# EAGLE design BPv4LCDadapter.v4b (EAGLE 5.07)
LEFT: FIXED ON; OFF: OFF; ON: ON; RIGHT: AUX CTRL
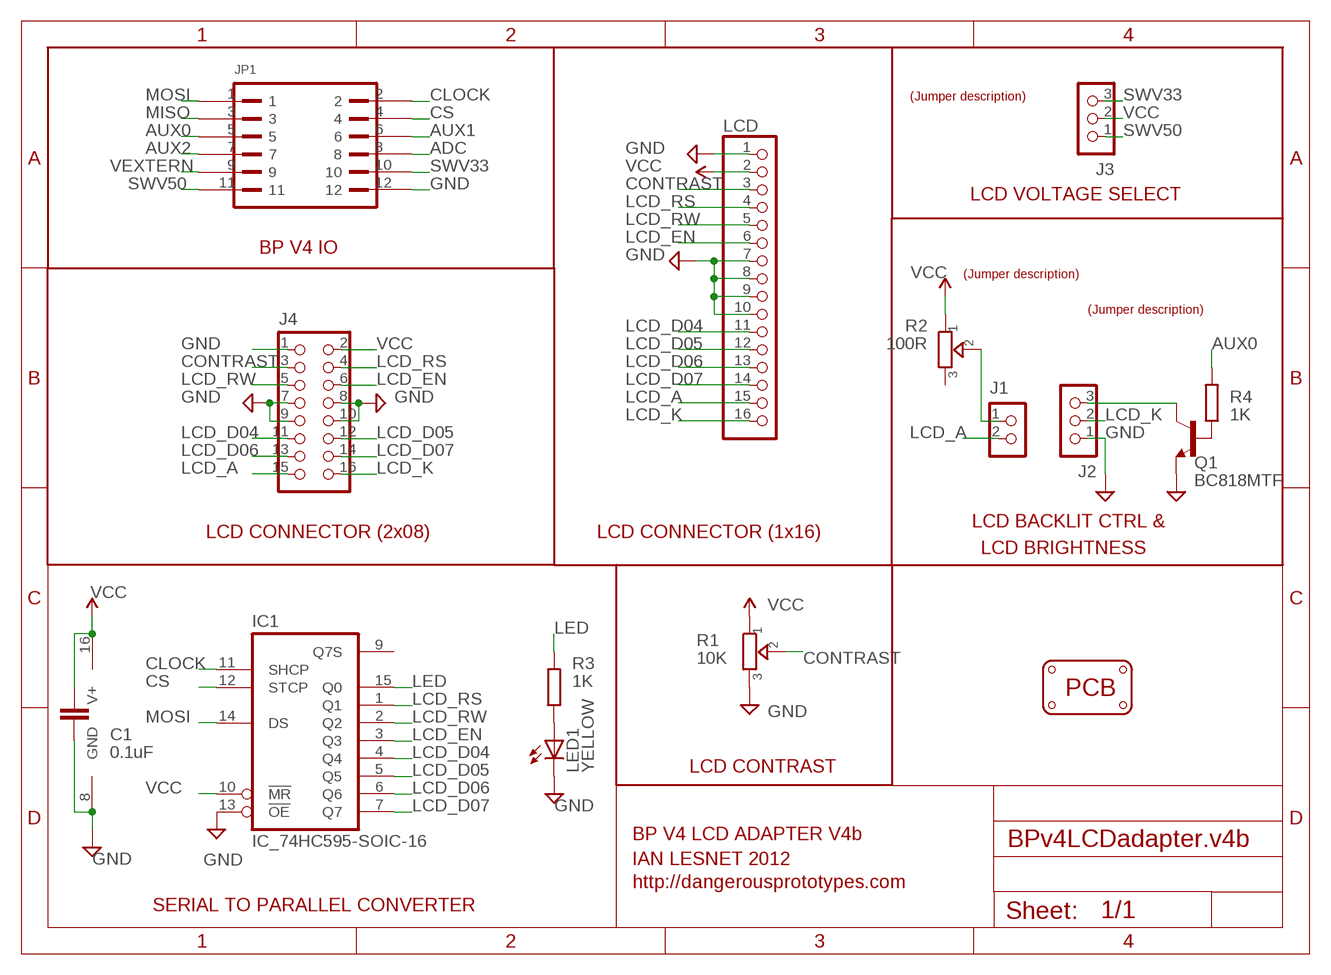
[diagram p0: schematic, sheet 1]

## Parts
C1  0.1uF  CAPACITOR_NPOL-0603  [C603]
IC1  IC_74HC595-SOIC-16  [SOIC-16]
J1  CON_HEADER_1X02-PTH  [M1X2]
J2  CON_HEADER_1X03-PTH  [M1X3]
J3  CON_HEADER_1X03-PTH  [M1X3]
J4  CON_HEADER_2X8  [M2X8]
JP1  PINSHRD-PTH-2X06  [PINSHRD_PTH_2X06@1]
LCD  PINHD-1X16  [1X16]
LED1  YELLOW  LED-0805  [LED-805]
PCB1  PCB_DP_RECTANGLE-37X60  [DP6037_V1]
Q1  BC818MTF  TRANSISTOR_BJT_NPN-SOT-23-BEC  [SOT-23]
R1  10K  TRIMMER-3306F  [TRIMMER_3306F]
R2  100R  TRIMMER-3306F  [TRIMMER_3306F]
R3  1K  RESISTOR-0603  [R603]
R4  1K  RESISTOR-0603  [R603]
U$7  LABEL_JUMPER_1X3  [JUMP3_DESC]
U$8  LABEL_JUMPER_1X2  [JUMP2_DESC]
U$9  LABEL_JUMPER_1X3  [JUMP3_DESC]

## Nets
ADC: JP1.8
AUX0: JP1.5 R4.2
AUX1: JP1.6
AUX2: JP1.7
CLOCK: IC1.11(SHCP) JP1.2
CONTRAST: J4.3 LCD.3 R1.2
CS: IC1.12(STCP) JP1.4
GND: C1.2 IC1.8(GND) IC1.13(!OE) J2.1 J4.1 J4.7 J4.8 J4.9 J4.10 JP1.12 LCD.1 LCD.7 LCD.8 LCD.9 LCD.10 LED1.C Q1.2(E) R1.3
LCD_A: J1.2 J4.15 LCD.15
LCD_D04: IC1.4(Q4) J4.11 LCD.11
LCD_D05: IC1.5(Q5) J4.12 LCD.12
LCD_D06: IC1.6(Q6) J4.13 LCD.13
LCD_D07: IC1.7(Q7) J4.14 LCD.14
LCD_EN: IC1.3(Q3) J4.6 LCD.6
LCD_K: J2.2 J4.16 LCD.16
LCD_RS: IC1.1(Q1) J4.4 LCD.4
LCD_RW: IC1.2(Q2) J4.5 LCD.5
LED: IC1.15(Q0) R3.2
MISO: JP1.3
MOSI: IC1.14(DS) JP1.1
N$1: J1.1 R2.2
N$2: Q1.1(B) R4.1
N$3: J2.3 Q1.3(C)
N$5: LED1.A R3.1
SWV33: J3.3 JP1.10
SWV50: J3.1 JP1.11
VCC: C1.1 IC1.10(!MR) IC1.16(V+) J3.2 J4.2 LCD.2 R1.1 R2.1
VEXTERN: JP1.9
Unconnected: IC1.9(Q7S) R2.3

## Notes on the sheet
- LCD VOLTAGE SELECT
- BP V4 IO
- LCD BACKLIT CTRL &
- LCD CONNECTOR (2x08) | LCD CONNECTOR (1x16)
- LCD BRIGHTNESS
- LCD CONTRAST
- BP V4 LCD ADAPTER V4b
- IAN LESNET 2012
- http://dangerousprototypes.com
- SERIAL TO PARALLEL CONVERTER

## Library data of the parts
C1 = dp_devices:CAPACITOR_NPOL: Non-Polarized capacitor in various packages
IC1 = dp_devices:IC_74HC595: 8-bit serial-in parallel out shift register, output latch 3-state
J1 = dp_devices:CON_HEADER_1X02
J2 J3 = dp_devices:CON_HEADER_1X03
J4 = dp_devices:CON_HEADER_2X8
JP1 = dp_devices:PINSHRD-PTH-2X06: Shrouded pin header, 2.54mm pitch
LCD = pinhead:PINHD-1X16: PIN HEADER
LED1 = dp_devices:LED: Light Emitting Diode
PCB1 = PCBStandards:PCB_DP_RECTANGLE: Dangerous Prototypes Standard Rectangular PCB sizes
Q1 = dp_devices:TRANSISTOR_BJT_NPN: Most commonly used is SOT23-BEC
R1 R2 = dp_devices:TRIMMER: Trimmer resistor
R3 R4 = dp_devices:RESISTOR
U$7 U$9 = dp_devices:LABEL_JUMPER_1X3: Nice formatted three legged jumperdescription Use attributes to change the values LEFT = With jumper to the left RIGHT = With jumper to the right; LEFT: left; RIGHT: right
U$8 = dp_devices:LABEL_JUMPER_1X2: Nice formatted two legged jumperdescription Use attributes to change the values ON = With jumper OFF = Without jumper; OFF: off; ON: on

## Board
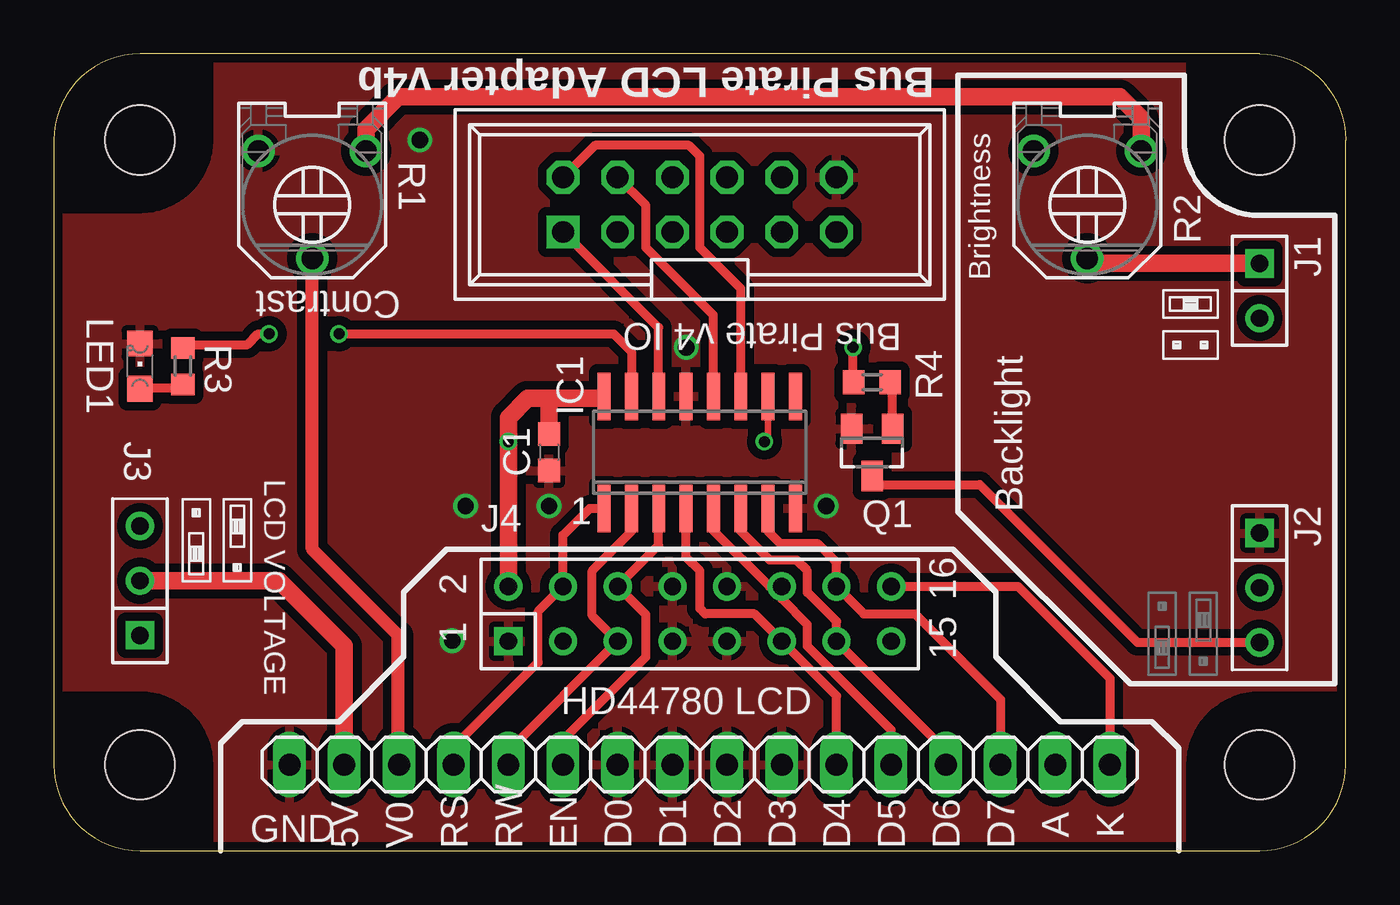
[diagram p1: board, top side]
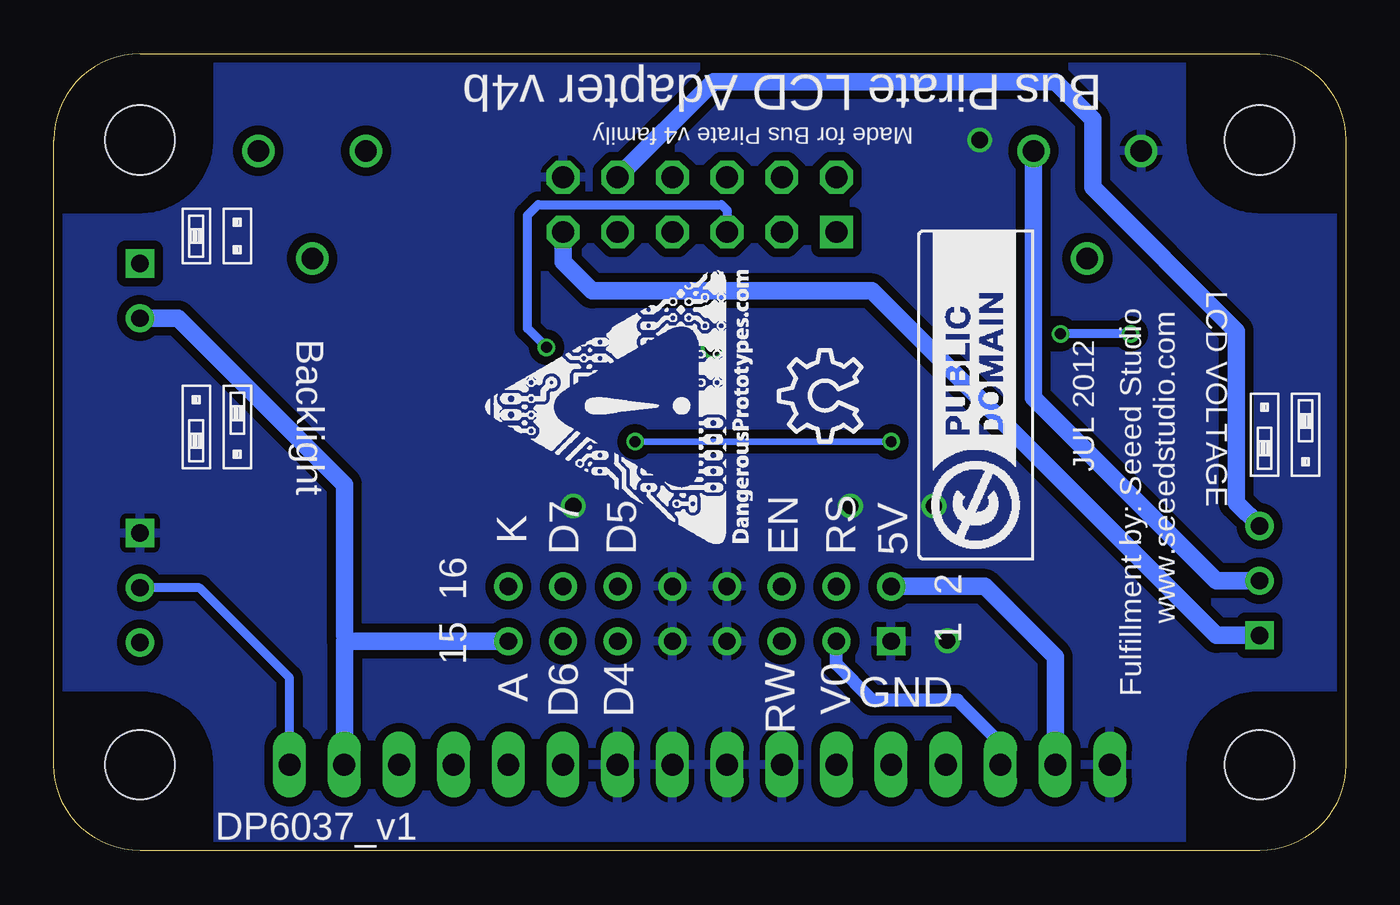
[diagram p2: board, bottom side, seen from below]

Size 60 x 37 mm. Coordinates in mm from the lower left corner, seen from the top.
Copper layers (1*16): Top 0.035mm / dielectric 1.5mm / Bottom 0.035mm
Design rules "Fusion_eagle_rule_v1.1": minimum track width 6mil, minimum drill 12mil, track to track 6mil, track to pad 6mil, pad to pad 6mil, via to via 6mil, smd to smd 0mil, copper to edge 10mil, drill to drill 10mil, minimum pad ring 10mil, minimum via ring 6mil, stop-mask expansion 2mil, vias tented up to drill 100mil, thermal gap 10mil

### Footprints (pad centres in the part's own frame; a part is rotated, then mirrored left to right if it is on the bottom)
C603 = smd 1.1 x 1: 1 -0.85,0; 2 0.85,0
SOIC-16 = smd 0.6 x 2.2: 1 -4.445,-2.6; 2 -3.175,-2.6; 3 -1.905,-2.6; 4 -0.635,-2.6; 5 0.635,-2.6; 6 1.905,-2.6; 7 3.175,-2.6; 8 4.445,-2.6; 9 4.445,2.6; 10 3.175,2.6; 11 1.905,2.6; 12 0.635,2.6; 13 -0.635,2.6; 14 -1.905,2.6; 15 -3.175,2.6; 16 -4.445,2.6
M1X2 = drill 0.8 square: 1 -1.27,0 | drill 0.8 round: 2 1.27,0
M1X3 = drill 0.8 square: 1 0,0 | drill 0.8 round: 2 2.54,0; 3 5.08,0
M2X8 = drill 0.8 square: 1 -8.89,-1.27 | drill 0.8 round: 2 -8.89,1.27; 3 -6.35,-1.27; 4 -6.35,1.27; 5 -3.81,-1.27; 6 -3.81,1.27; 7 -1.27,-1.27; 8 -1.27,1.27; 9 1.27,-1.27; 10 1.27,1.27; 11 3.81,-1.27; 12 3.81,1.27; 13 6.35,-1.27; 14 6.35,1.27; 15 8.89,-1.27; 16 8.89,1.27
PINSHRD_PTH_2X06@1 = drill 1.016 square: 1 -6.35,-1.27 | drill 1.016 octagon: 2 -6.35,1.27; 3 -3.81,-1.27; 4 -3.81,1.27; 5 -1.27,-1.27; 6 -1.27,1.27; 7 1.27,-1.27; 8 1.27,1.27; 9 3.81,-1.27; 10 3.81,1.27; 11 6.35,-1.27; 12 6.35,1.27
1X16 = drill 1.016 long: 1 -19.05,0; 2 -16.51,0; 3 -13.97,0; 4 -11.43,0; 5 -8.89,0; 6 -6.35,0; 7 -3.81,0; 8 -1.27,0; 9 1.27,0; 10 3.81,0; 11 6.35,0; 12 8.89,0; 13 11.43,0; 14 13.97,0; 15 16.51,0; 16 19.05,0
LED-805 = smd 1.2 x 1.2: A 0,-1.05; C 0,1.05
DP6037_V1 = hole 3.2: 4,4; 56,4; 56,33; 4,33
SOT-23 = smd 1 x 1.4: 1 -0.95,-1.1; 2 0.95,-1.1; 3 0,1.1
TRIMMER_3306F = drill 1 round: 1 -2.5,-2.5; 2 0,2.5; 3 2.5,-2.5
R603 = smd 1 x 1.1: 1 -0.85,0; 2 0.85,0

### Placement (x,y rotation side)
C1  23,18.5 270 top
IC1  30,18.5 0 top
J1  56,26 270 top
J2  56,14.75 270 top
J3  4,10 90 top
J4  30,11 0 top
JP1  30,30 0 top
LCD  30,4 0 top
LED1  4,22.5 0 top
PCB1  0,0 0 top
Q1  38,18.5 180 top
R1  12,30 180 top
R2  48,30 180 top
R3  6,22.5 90 top
R4  38,21.75 180 top
U$1  [DP_LOGO_ART_0.5X0.5]  27.57,14.26 90 bottom
U$2  LABEL_JUMPER_1X3  [JUMP3_DESC@1]  52.75,13.25 90 top
U$3  [LOGO_CC-0]  14.5,13.5 90 bottom
U$4  [OSHW_8X150_NOTEXT]  22.5,19 90 bottom
U$5  LABEL_JUMPER_1X3  [JUMP3_DESC]  7.25,11.25 270 top
U$6  LABEL_JUMPER_1X2  [JUMP2_DESC]  50.25,24.75 180 top
U$7  52.75,16.5 270 bottom
U$8  52.75,26 270 bottom
U$9  2.5,22.5 90 bottom

### Tracks (layer width: path | path; a pad name or v marks a point on that pad's centre or on a via)
AUX0  (via drill 0.51)
  Top 0.305: R4.2 37.12,21.77
  Top 0.406: 37.12,21.77 v37.12,23.38
  Bottom 0.406: JP1.5 28.73,29.73 29,30 37.5,30 38,29.5 38,24.25 v37.12,23.38
CLOCK
  Top 0.406: IC1.11 31.91,26.09 30,28 30,32.25 29.5,32.75 25.13,32.75 JP1.2
CONTRAST
  Top 0.61: R1.2 12,14 16,10 16,4.03 LCD.3
  Bottom 0.61: J4.3 23.65,8.65 22,7 18.03,7 16.03,5 LCD.3
CS
  Top 0.406: IC1.12 30.64,24.86 27.5,28 27.5,29.96 JP1.4
GND  (via drill 0.76)
  other vias: 23,16 35.88,16 29.38,23.38 17,33 19.12,16 18.5,9.75
  pour Bottom (isolate 0.406): 0,37 60,37 60,0 0,0
  pour Top (isolate 0.406): 0,37 60,37 60,0 -0.5,0
LCD_A
  Bottom 0.406: LCD.15 | 46.5,9.73 46.5,10
  Bottom 0.813: J1.2 54.23,24.73 46.5,17 46.5,10 | LCD.15 46.5,9.73 J4.15
LCD_D04
  Top 0.406: LCD.11 36.35,7.19 J4.11 32.54,11 30.25,11 30,11.25 30,13 29.36,13.63 IC1.4
LCD_D05
  Top 0.406: LCD.12 38.89,5.61 35,9.5 35,10.5 33.81,11.69 J4.12 33.23,12.27 30.64,14.87 IC1.5
LCD_D06
  Top 0.406: LCD.13 41.43,4.65 J4.13 36.35,10.65 35,12 35,13 34.5,13.5 33.25,13.5 31.91,14.85 IC1.6
LCD_D07
  Top 0.406: LCD.14 43.97,7.03 40,11 37.62,11 J4.14 36.35,13.4 35.5,14.25 33.75,14.25 33.17,14.82 IC1.7
LCD_EN
  Top 0.406: LCD.6 23.65,5.15 27.5,9 27.5,10.96 J4.6 28.09,14.18 IC1.3
LCD_K
  Top 0.406: J4.16 44.78,12.27 49.05,8 LCD.16
  Bottom 0.406: LCD.16 49.05,8.03 53.23,12.21 J2.2
LCD_RS
  Top 0.406: LCD.4 18.57,4.82 22.5,8.75 22.5,11.12 J4.4 23.65,14.65 24.9,15.9 IC1.1
LCD_RW
  Top 0.406: LCD.5 21.11,4.65 J4.5 25,10.92 25,13 26.82,14.82 IC1.2
LED  (via drill 0.51)
  Top 0.305: R3.2 6.15,23.5
  Top 0.406: IC1.15 26.82,23.18 26,24 v13.25,24 | v10,24 9.5,24 9,23.5 6.15,23.5
  Bottom 0.406: v10,24 v13.25,24
MOSI
  Top 0.406: IC1.14 28.09,24.29 JP1.1
N$1
  Top 0.813: J1.1 48.23,27.27 R2.2
N$2
  Top 0.406: Q1.1 38.95,21.65 R4.1
N$3
  Top 0.406: Q1.3 38.4,17 43,17 50.33,9.67 J2.3
N$5
  Top 0.406: R3.1 6,21.5 4.05,21.5 LED1.A
SWV33
  Bottom 0.813: JP1.10 29.37,35.71 13.49,35.71 11.75,33.97 11.75,30.8 5.08,24.13 5.08,16.16 J3.3
SWV50
  Bottom 0.813: JP1.11 36.35,27.35 35,26 22,26 6,10 J3.1
VCC  (via drill 0.51)
  Top 0.305: IC1.10 33.17,19.18 v33,19
  Top 0.61: 25.45,21 IC1.16
  Top 0.813: J3.2 10.46,12.54 13.49,9.51 LCD.2 | J4.2 v21.11,19 21.11,20.11 22,21 23,21 | 23,21 25.45,21 | 23,21 C1.1 | R1.1 14.5,33.5 16,35 49.5,35 50.5,34 R2.1
  Bottom 0.305: v21.11,19 v33,19
  Bottom 0.813: J4.2 16.76,12.27 13.49,9 LCD.2 | R1.1 14.5,21.04 6,12.54 J3.2

### Text on the board
tNames: Bus Pirate LCD Adapter v4b | Contrast | Brightness | Bus Pirate v4 IO | LCD VOLTAGE | Backlight | 1 | 16 | 2 | 1 | 15 | HD44780 LCD | A | K | GND | 5V | V0 | RS | RW | EN | D0 | D1 | D2 | D3 | D4 | D5 | D6 | D7
bNames: Bus Pirate LCD Adapter v4b | Made for Bus Pirate v4 family | LCD VOLTAGE | JUL 2012 | Backlight | 5V | RS | EN | D5 | D7 | K | 16 | 2 | www.seeedstudio.com | 1 | 15 | V0 | RW | D4 | D6 | GND | A | Fulfillment by: Seeed Studio